# Altium schematic sheet tourellesEmetteurs.SchDoc: Tourelle
size A4
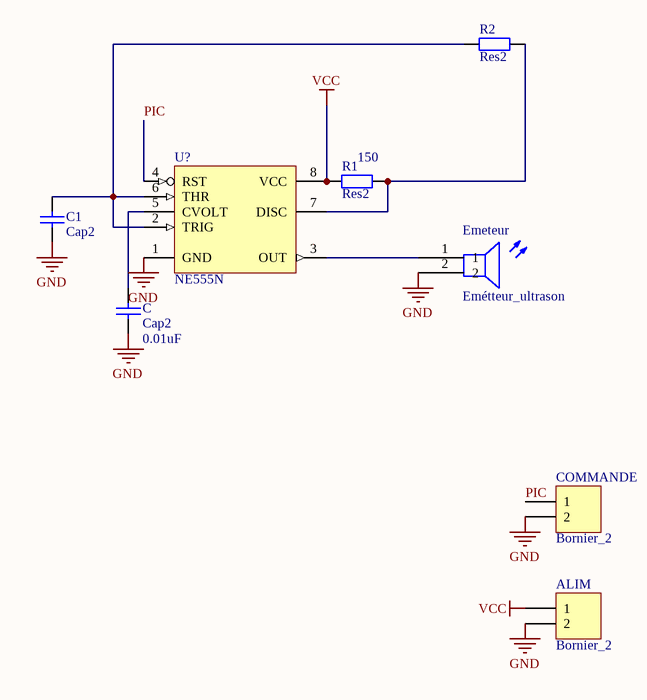
[diagram p0: tourellesEmetteurs.SchDoc]

## Parts
ALIM  Bornier_2  [Bornier_2]
C  Cap2  value 0.01uF  [CAPA2]
C1  Cap2  [CAPA2]
COMMANDE  Bornier_2  [Bornier_2]
Emeteur  Emétteur_ultrason  [TX/RX_ultrason]
R1  Res2  value 150  [res5_1/4W]
R2  Res2  [res5_1/4W]
U?  NE555N  [DIP8]

## Nets
GND: ALIM.2 C.1 C1.1 COMMANDE.2 Emeteur.2 U?.1(GND)
VCC: ALIM.1 R1.2 U?.8(VCC)
PIC: COMMANDE.1 U?.4(RST)
NetC1_2: C1.2 R2.1 U?.2(TRIG) U?.6(THR)
NetC_2: C.2 U?.5(CVOLT)
NetEmeteur_1: Emeteur.1 U?.3(OUT)
NetR1_1: R1.1 R2.2 U?.7(DISC)

## Notes on the sheet
- Title :
- Size:
- A4
- Date:
- Time:
- File:

## Library data of the parts
ALIM COMMANDE = Bornier_2: Header, 2-Pin; LatestRevisionDate: 17-Jul-2002; LatestRevisionNote: Re-released for DXP Platform.; Publisher: Altium Limited
C C1 = Cap2: Capacitor; Published: 8-Jun-2000; LatestRevisionDate: 17-Jul-2002; LatestRevisionNote: Re-released for DXP Platform.; PackageReference: RAD-0.3; Publisher: Altium Limited
Emeteur = Emétteur_ultrason: RX_ultrason; Published: 24-Mar-1999; LatestRevisionDate: 17-Jul-2002; LatestRevisionNote: Re-released for DXP Platform.; PackageReference: PIN2; Publisher: Altium Limited
R1 = Res2: Resistor; Published: 8-Jun-2000; LatestRevisionDate: 17-Jul-2002; LatestRevisionNote: Re-released for DXP Platform.; PackageReference: AXIAL-0.4; Publisher: Altium Limited
R2 = Res2: Resistor; Value: 1K; Published: 8-Jun-2000; LatestRevisionDate: 17-Jul-2002; LatestRevisionNote: Re-released for DXP Platform.; PackageReference: AXIAL-0.4; Publisher: Altium Limited
U? = NE555N: General-Purpose Single Bipolar Timer; Published: 24-Aug-2001; LatestRevisionDate: 06-Jun-2005; LatestRevisionNote: Stylized 3D Model Added.; DatasheetVersion: Jul-1998; PackageReference: DIP8; Publisher: Altium Limited; PackageDescription: DIP; 8 Leads; Row Spacing 7.62 mm; Pitch 2.54 mm; Code_JEDEC: MO-001-AN; ComponentLink1Description: Manufacturer Link; ComponentLink1URL: http://www.st.com/; ComponentLink2Description: Datasheet; ComponentLink2URL: http://www.st.com/stonline/products/literature/ds/2182/ne555.pdf